# Altium project IRAUPS3.PrjPCB
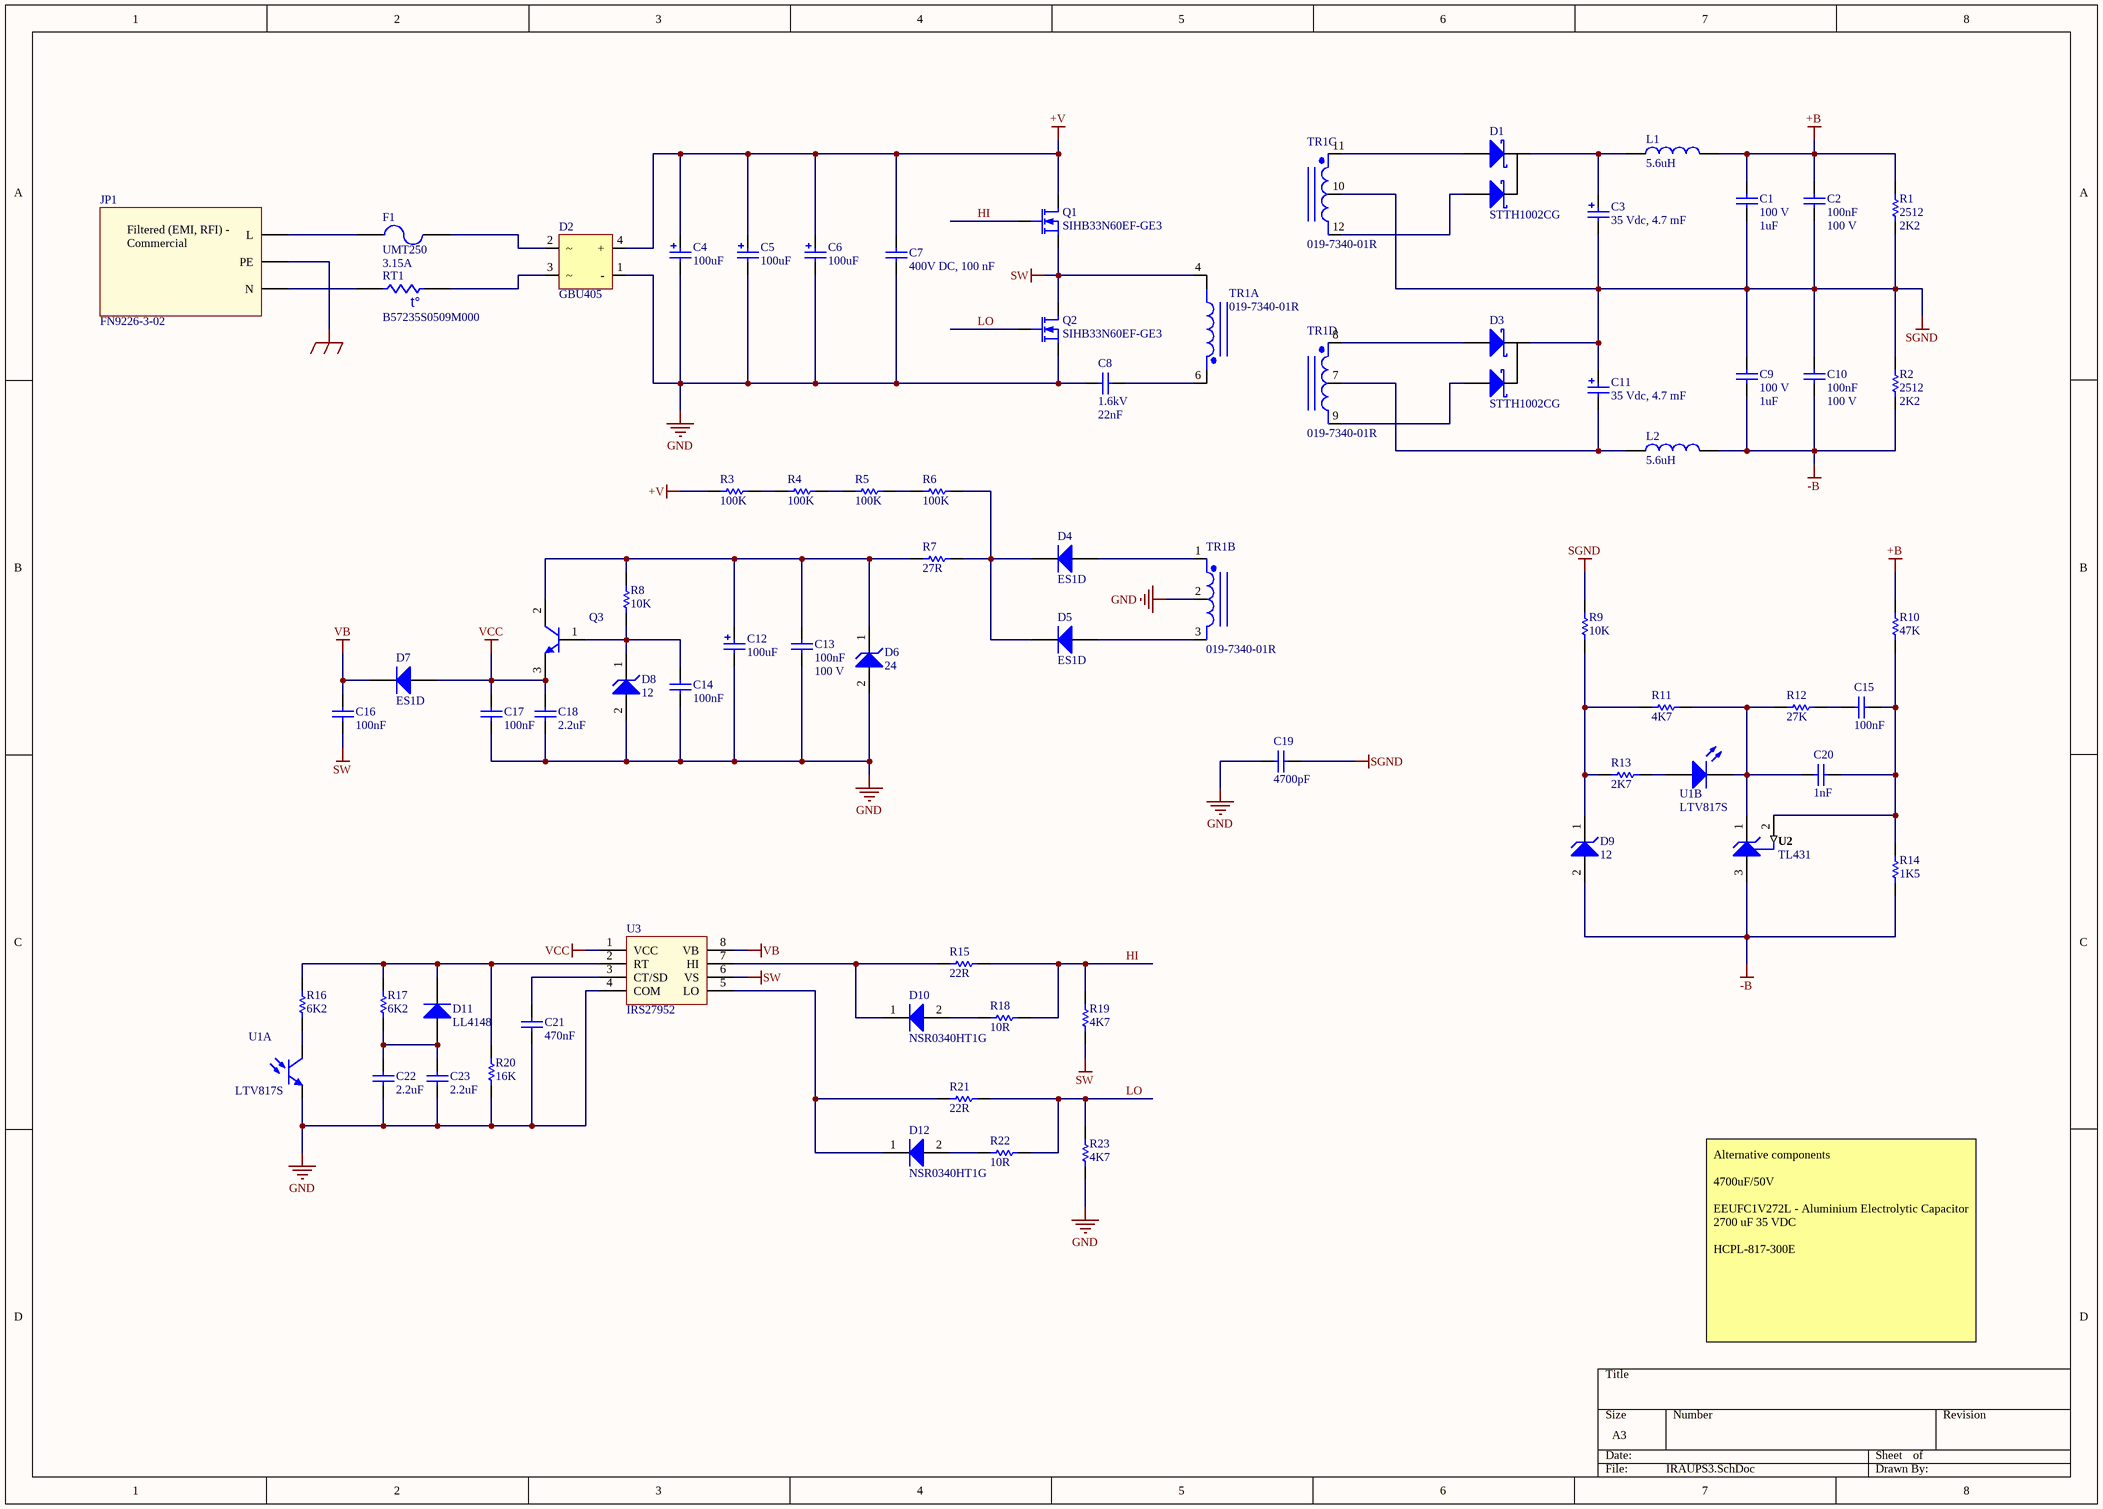
[diagram p0: IRAUPS3.SchDoc]
1 sheet, 70 parts. Net scope: global (net labels, ports and power ports of the same name join across sheets).
Board file: IRAUPS3.PcbDoc

## Sheet IRAUPS3.SchDoc
size A3

### Parts
C1  value 1uF  Rated Voltage: 100 V  [CAPC1206(3216)190_L]  (hidden comment: CAP 1uF 100V 1206(3216))
C2  value 100nF  Rated Voltage: 100 V  [CAPC1206(3216)150_M]  (hidden comment: CAP 100nF 100V 1206(3216))
C3  35 Vdc, 4.7 mF  [WCAP-ATG8_18x35.5x7.5]
C4  value 100uF  [WCAP-AT1H_16x35.5x7.5]  (hidden comment: 860241480001)
C5  value 100uF  [WCAP-AT1H_16x35.5x7.5]  (hidden comment: 860241480001)
C6  value 100uF  [WCAP-AT1H_16x35.5x7.5]  (hidden comment: 860241480001)
C7  400V DC, 100 nF  [WCAP-FTBE_13x5x11]
C8  value 22nF  Voltage: 1.6kV  [CAP_RM15_W9L18]  (hidden comment: B32672L1223J000)
C9  value 1uF  Rated Voltage: 100 V  [CAPC1206(3216)190_L]  (hidden comment: CAP 1uF 100V 1206(3216))
C10  value 100nF  Rated Voltage: 100 V  [CAPC1206(3216)150_M]  (hidden comment: CAP 100nF 100V 1206(3216))
C11  35 Vdc, 4.7 mF  [WCAP-ATG8_18x35.5x7.5]
C12  value 100uF  [WCAP-AT1H_8x11.5x3.5]  (hidden comment: 860240474005)
C13  value 100nF  Rated Voltage: 100 V  [CAPC1206(3216)150_M]  (hidden comment: CAP 100nF 100V 1206(3216))
C14  value 100nF  [CAPC0805(2012)100_N]  (hidden comment: CAP 100nF 25V 0805(2012))
C15  value 100nF  [CAPC0805(2012)100_N]  (hidden comment: CAP 100nF 25V 0805(2012))
C16  value 100nF  [CAPC0805(2012)100_N]  (hidden comment: CAP 100nF 25V 0805(2012))
C17  value 100nF  [CAPC0805(2012)100_N]  (hidden comment: CAP 100nF 25V 0805(2012))
C18  value 2.2uF  [CAPC0805(2012)145_N]  (hidden comment: CAP 2.2uF 25V 0805(2012))
C19  value 4700pF  [CAP_VY2472M49Y5US63V7]  (hidden comment: VY2472M49Y5US63V7)
C20  value 1nF  [CAPC0805(2012)100_N]  (hidden comment: CAP 1nF 25V 0805(2012))
C21  value 470nF  [CAPC0805(2012)100_N]  (hidden comment: CAP 470nF 25V 0805(2012))
C22  value 2.2uF  [CAPC0805(2012)145_N]  (hidden comment: CAP 2.2uF 25V 0805(2012))
C23  value 2.2uF  [CAPC0805(2012)145_N]  (hidden comment: CAP 2.2uF 25V 0805(2012))
D1  STTH1002CG  [TO-263_L]
D2  GBU405  [DIOD_BRIDGE_GBU]
D3  STTH1002CG  [TO-263_L]
D4  ES1D  [FAIR-SMA-2_V]
D5  ES1D  [FAIR-SMA-2_V]
D6  VZ Typ (V): 24  [ONSC-SMA-2-403D-02_F_V]  (hidden comment: 1SMA5934BT3G)
D7  ES1D  [FAIR-SMA-2_V]
D8  VZ Typ (V): 12  [ONSC-SMA-2-403D-02_F_V]  (hidden comment: 1SMA5927BT3G)
D9  VZ Typ (V): 12  [ONSC-SMA-2-403D-02_F_V]  (hidden comment: 1SMA5927BT3G)
D10  NSR0340HT1G  [ONSC-SOD-323-2-477-02_V]
D11  LL4148  [DIOD-SOD-80]
D12  NSR0340HT1G  [ONSC-SOD-323-2-477-02_V]
F1  UMT250  value 3.15A  [FUSE_UMT250]
JP1  FN9226-3-02  [CONN-FN9226-3-02]
L1  value 5.6uH  [WE-HCI_5040_WE-PERM 2]  (hidden comment: 744316560)
L2  value 5.6uH  [WE-HCI_5040_WE-PERM 2]  (hidden comment: 744316560)
Q1  SIHB33N60EF-GE3  [D2PAK_L]
Q2  SIHB33N60EF-GE3  [D2PAK_L]
Q3  2SC5569-TD-E  [ONSC-SOT-89-3-419AW_V]  (value not drawn)
R1  value 2K2  Case-EIA: 2512  [RESC2512(6432)_L]  (hidden comment: 2K2 5% 2512(6432))
R2  value 2K2  Case-EIA: 2512  [RESC2512(6432)_L]  (hidden comment: 2K2 5% 2512(6432))
R3  value 100K  [RESC1206(3216)_N]  (hidden comment: 100K 5% 1206(3216))
R4  value 100K  [RESC1206(3216)_N]  (hidden comment: 100K 5% 1206(3216))
R5  value 100K  [RESC1206(3216)_N]  (hidden comment: 100K 5% 1206(3216))
R6  value 100K  [RESC1206(3216)_N]  (hidden comment: 100K 5% 1206(3216))
R7  value 27R  [RESC0805(2012)_N]  (hidden comment: 27R 5% 0805(2012))
R8  value 10K  [RESC0805(2012)_N]  (hidden comment: 10K 5% 0805(2012))
R9  value 10K  [RESC0805(2012)_N]  (hidden comment: 10K 5% 0805(2012))
R10  value 47K  [RESC0805(2012)_N]  (hidden comment: 47K 5% 0805(2012))
R11  value 4K7  [RESC0805(2012)_N]  (hidden comment: 4K7 5% 0805(2012))
R12  value 27K  [RESC0805(2012)_N]  (hidden comment: 27K 5% 0805(2012))
R13  value 2K7  [RESC0805(2012)_N]  (hidden comment: 2K7 5% 0805(2012))
R14  value 1K5  [RESC0805(2012)_L]  (hidden comment: 1K5 5% 0805(2012))
R15  value 22R  [RESC0805(2012)_N]  (hidden comment: 22R 5% 0805(2012))
R16  value 6K2  [RESC0805(2012)_N]  (hidden comment: 6K2 1% 0805(2012))
R17  value 6K2  [RESC0805(2012)_N]  (hidden comment: 6K2 1% 0805(2012))
R18  value 10R  [RESC0805(2012)_N]  (hidden comment: 10R 5% 0805(2012))
R19  value 4K7  [RESC0805(2012)_N]  (hidden comment: 4K7 5% 0805(2012))
R20  value 16K  [RESC0805(2012)_N]  (hidden comment: 16K 1% 0805(2012))
R21  value 22R  [RESC0805(2012)_N]  (hidden comment: 22R 5% 0805(2012))
R22  value 10R  [RESC0805(2012)_N]  (hidden comment: 10R 5% 0805(2012))
R23  value 4K7  [RESC0805(2012)_N]  (hidden comment: 4K7 5% 0805(2012))
RT1  B57235S0509M000  [RES_TH_9.5mm]
TR1  019-7340-01R  [TRAN_019-7340-01R]  (parts A,B,C,D of 4)
U1  LTV817S  [SMD-4]  (parts A,B of 2)
U2  TL431  [DBZ0003A_M]
U3  IRS27952  [SOIC8_L]

### Nets
+B: C1.2 C2.2 L1.2 R1.2 R10.2
+V: C4.1(P) C5.1(P) C6.1(P) C7.2 D2.4(+) Q1.4(D) R3.2
-B: C9.1 C10.1 D9.2(A) L2.2 R2.1 R14.2 U2.3(ANODE)
GND: C4.2(N) C5.2(N) C6.2(N) C7.1 C8.1 C12.2(N) C13.1 C14.1 C17.1 C18.1 C19.1 C21.1 C22.1 C23.1 D2.1(-) D6.2(A) D8.2(A) Q2.3(S) R20.1 R23.1 TR1.2 U1.3(E) U3.4(COM)
PE: JP1.PE
SGND: C1.1 C2.1 C3.2(N) C9.2 C10.2 C11.1(P) C19.2 D3.4(K) R1.1 R2.2 R9.2 TR1.10
SW: C16.1 Q1.3(S) Q2.4(D) R19.1 TR1.4 U3.6(VS)
VB: C16.2 D7.1(K) U3.8(VB)
VCC: C17.2 C18.2 D7.2(A) Q3.3(E) U3.1(VCC)
HI: Q1.1(G) R15.2 R18.2 R19.2
LO: Q2.1(G) R21.2 R22.2 R23.2
NetC3_1: C3.1(P) D1.4(K) L1.1
NetC8_2: C8.2 TR1.6
NetC11_2: C11.2(N) L2.1 TR1.7
NetC12_1: C12.1(P) C13.2 D6.1(K) Q3.2(C) R7.2 R8.2
NetC14_2: C14.2 D8.1(K) Q3.1(B) R8.1
NetC15_1: C15.1 R12.2
NetC15_2: C15.2 C20.2 R10.1 R14.1 U2.2(REF)
NetC20_1: C20.1 R11.1 R12.1 U1.2(K) U2.1(CATHODE)
NetC21_2: C21.2 U3.3(CT/SD)
NetC22_2: C22.2 C23.2 D11.1(A) R17.1
NetD1_1: D1.1(A1) TR1.11
NetD1_3: D1.3(A2) TR1.12
NetD2_2: D2.2 F1.2
NetD2_3: D2.3 RT1.1
NetD3_1: D3.1(A1) TR1.8
NetD3_3: D3.3(A2) TR1.9
NetD4_1: D4.1(K) D5.1(K) R6.1 R7.1
NetD4_2: D4.2(A) TR1.1
NetD5_2: D5.2(A) TR1.3
NetD9_1: D9.1(K) R9.1 R11.2 R13.2
NetD10_1: D10.1(K) R15.1 U3.7(HI)
NetD10_2: D10.2(A) R18.1
NetD11_2: D11.2(K) R16.2 R17.2 R20.2 U3.2(RT)
NetD12_1: D12.1(K) R21.1 U3.5(LO)
NetD12_2: D12.2(A) R22.1
NetF1_1: F1.1 JP1.L
NetJP1_N: JP1.N RT1.2
NetR3_1: R3.1 R4.2
NetR4_1: R4.1 R5.2
NetR5_1: R5.1 R6.2
NetR13_1: R13.1 U1.1(A)
NetR16_1: R16.1 U1.4(C)

### Notes on the sheet
- Alternative components
  4700uF/50V
  EEUFC1V272L - Aluminium Electrolytic Capacitor 2700 uF 35 VDC
  HCPL-817-300E
- (in symbol CONN_FN9226-3-02) Filtered (EMI, RFI) - Commercial
- (in symbol RES_B57235S0509M000) t°

### Library data of the parts
C1 C9 = CMP-1037-04729-1: CAP 1uF 100V ±20% 1206 (3216 Metric) Thickness 1.9mm SMD; Case-EIA: 1206; Case-Metric: 3216; Tolerance: Â±20%; Max Thickness: 1.9 mm; Technology: SMT
C2 C10 C13 = CMP-1037-04216-1: CAP 100nF 100V ±20% 1206 (3216 Metric) Thickness 1.45mm SMD; Case-Metric: 3216; Case-EIA: 1206; Tolerance: Â±20%; Max Thickness: 1.45 mm; Technology: SMT
C3 C11 = 860010581025: WCAP-ATG8 Aluminum Electrolytic Capacitors, 18x35.5mm, 35 Vdc, 4.7 mF; Rated Voltage: 35 Vdc; Value: 4.7 mF; ComponentLink1Description: Manufacturer; ComponentLink1URL: http://www.we-online.de; ComponentLink2Description: Datasheet; ComponentLink2URL: http://katalog.we-online.de/pbs/datasheet/860010581025.pdf; Part Number: 860010581025; Published Date: Sep. 2017; Publisher: Wurth Elektronik; Size: 18x35.5mm; Life Cycle: 2000h; Operating Temperature: -40 °C up to +85 °C
C4-C6 = 860241480001: WCAP-AT1H Aluminum Electrolytic Capacitors, size Ф16x35.5mm, 450V DC, 100uF; Rated Voltage: 450V DC; ComponentLink1Description: Manufacturer; ComponentLink1URL: http://www.we-online.de; ComponentLink2Description: Datasheet; ComponentLink2URL: http://katalog.we-online.de/pbs/datasheet/860241480001.pdf; Part Number: 860241480001; Published Date: June 2017; Publisher: Wurth Elektronik; Size: Ф16x35.5mm; Life Cycle: 5000h; Operating Temperature: -25 °C up to +105 °C
C7 = 890283423001CS: WCAP-FTBE Film Capacitors, 13x5x11mm, 400V DC, 100 nF; Rated Voltage: 400V DC; Value: 100 nF; ComponentLink1Description: Manufacturer; ComponentLink1URL: http://www.we-online.de; ComponentLink2Description: Datasheet; ComponentLink2URL: http://katalog.we-online.de/pbs/datasheet/890283423001CS.pdf; Part Number: 890283423001CS; Published Date: Sep. 2017; Publisher: Wurth Elektronik; Size: 13x5x11mm; Operating Temperature: -40 °C to +85 °C
C8 = CAP_MKP_B32672L1223J000: 0.022µF Film Capacitor 600V 1600V (1.6kV) Polypropylene (PP), Metallized Radial; PackageReference: RM15; Farnell: 2469009; MPN: B32672L1223J000; DigiKey: 495-3217-ND
C12 = 860240474005: WCAP-AT1H Aluminum Electrolytic Capacitors, size Ф8x11.5mm, 25V DC, 100uF; Rated Voltage: 25V DC; ComponentLink1Description: Manufacturer; ComponentLink1URL: http://www.we-online.de; ComponentLink2Description: Datasheet; ComponentLink2URL: http://katalog.we-online.de/pbs/datasheet/860240474005.pdf; Part Number: 860240474005; Published Date: June 2017; Publisher: Wurth Elektronik; Size: Ф8x11.5mm; Life Cycle: 8000h; Operating Temperature: -40 °C up to +105 °C
C14-C17 = CMP-1036-04409-1: CAP 100nF 25V ±5% 0805 (2012 Metric) Thickness 1mm SMD; Case-EIA: 0805; Case-Metric: 2012; Tolerance: Â±5%; Max Thickness: 1 mm; Technology: SMT; Rated Voltage: 25 V
C18 C22 C23 = CMP-1036-04837-1: CAP 2.2uF 25V ±10% 0805 (2012 Metric) Thickness 1.45mm SMD; Case-EIA: 0805; Tolerance: Â±10%; Case-Metric: 2012; Technology: SMT; Max Thickness: 1.45 mm; Rated Voltage: 25 V
C19 = CAP_VY2_4700: 4700pF ±20% 440VAC Ceramic Capacitor Y5U (E) Radial, Disc; PackageReference: THD; FARNELL: 1902233; MPN: VY2472M49Y5US63V7; Voltage: 440VAC; DigiKey: BC2359-ND
C20 = CMP-1036-02968-1: CAP 1nF 25V ±10% 0805 (2012 Metric) Thickness 1mm SMD; Case-EIA: 0805; Tolerance: Â±10%; Case-Metric: 2012; Rated Voltage: 25 V; Technology: SMT; Max Thickness: 1 mm
C21 = CMP-1036-04646-1: CAP 470nF 25V ±10% 0805 (2012 Metric) Thickness 1mm SMD; Tolerance: Â±10%; Case-EIA: 0805; Case-Metric: 2012; Max Thickness: 1 mm; Rated Voltage: 25 V; Technology: SMT
D1 D3 = DIODE-STTH1002CG: Diode Array 1 Pair Common Cathode Schottky 60V 15A Through Hole TO-220-3; MPN: STTH1002CG
D2 = DIOD_BRIDGE_GBU405: IC RECT BRIDGE 0.5A 600V 4SOIC; MPN: GBU405; Farnell: 4084780
D4 D5 D7 = CMP-2000-06230-1: Fairchild ES1D Diode, 200 V, 1 A, -50 to 150 degC, 2-Pin SMA, RoHS, Cut Tape; Manufacturer: Fairchild Semiconductor; Reverse Recovery Time-Max: 15ns; Reverse Current-Max: 5µA; Reverse Voltage-Max [Vrrm]: 200V; Power Dissipation: 1470mW; Average Rectified Current-Max: 1A; Forward Voltage: 0.92V; Datasheet URL: https://datasheet.ciiva.com/5739/575529-5739201.pdf; Datasheet Version: Rev. C1; Package Reference: SMA-2; Manufacturer URL: https://www.fairchildsemi.com/; Package Description: 2-Pin SMA, Body 4.292 x 2.693 mm; VRRM: 200V; Mounting Technology: SurfaceMount; IF: 1A; PartNumber: ES1D
D6 = CMP-1060-00064-1: 1.5 W Zener Voltage Regulator, 2-Pin SMA, Pb-Free, Tape and Reel; Manufacturer: On Semiconductor; Packing: Tape and Reel; PackageReference: SMA-2-403D-02_F; ComponentLink1Description: Manufacturer URL; ComponentLink2URL: http://www.onsemi.com/pub_link/Collateral/1SMA5913BT3-D.PDF; PackageDescription: 2-Pin Small Molded Package, J-Bend Lead, Body 2.605 x 4.315 mm; ComponentLink2Description: Datasheet; PackageVersion: Rev. F, 11/2008; RoHS: Pb-Free; ComponentLink3Description: Package Specification; DatasheetVersion: Rev. 8; PartNumber: 1SMA5934BT3G; ComponentLink1URL: http://www.onsemi.com/; Mounting Technology: Surface Mount; ComponentLink3URL: http://www.onsemi.com/pub_link/Collateral/1SMA5913BT3-D.PDF
D8 D9 = CMP-1060-00103-1: 1.5 W Zener Voltage Regulator, 2-Pin SMA, Pb-Free, Tape and Reel; Manufacturer: On Semiconductor; DatasheetVersion: Rev. 8; Mounting Technology: Surface Mount; RoHS: Pb-Free; Packing: Tape and Reel; ComponentLink2Description: Datasheet; ComponentLink1URL: http://www.onsemi.com/; PackageDescription: 2-Pin Small Molded Package, J-Bend Lead, Body 2.605 x 4.315 mm; PackageReference: SMA-2-403D-02_F; PartNumber: 1SMA5927BT3G; ComponentLink3URL: http://www.onsemi.com/pub_link/Collateral/1SMA5913BT3-D.PDF; ComponentLink1Description: Manufacturer URL; ComponentLink2URL: http://www.onsemi.com/pub_link/Collateral/1SMA5913BT3-D.PDF; PackageVersion: Rev. F, 11/2008; ComponentLink3Description: Package Specification
D10 D12 = CMP-1055-00472-1: Schottky Barrier Diode, 2-Pin SOD-323, Pb-Free, Tape and Reel; Manufacturer: On Semiconductor; IFSM Max (A): 1; Configuration: Single; PackageDescription: 2-Pin SOD, Body 1.7 x 1.25 mm; ComponentLink2Description: Datasheet; PartNumber: NSR0340HT1G; ComponentLink3URL: http://www.onsemi.com/pub_link/Collateral/477-02.PDF.1; Packing: Tape and Reel; PackageVersion: Rev. H, 03/2007; ComponentLink1URL: http://www.onsemi.com/; ComponentLink2URL: http://www.onsemi.cn/pub_link/Collateral/NSR0340H-D.PDF; ComponentLink3Description: Package Specification; ComponentLink1Description: Manufacturer URL; Mounting Technology: Surface Mount; RoHS: TRUE; PackageReference: SOD-323-2-477-02; DatasheetVersion: Rev. 1
D11 = DIOD_GP_LL4148: DIODE GEN PURP 100V 200MA SOD80; Code_JEDEC: SOD-80; FARNELL: 2101203; DigiKey: LL4148FSTR-ND; MPN: LL4148
F1 = FUSE_UMT250-3.15A: Fuse; MPN: 3403.0171.11; ELFA: 13322670; Farnell: 1221095; DigiKey: 486-1252-ND
JP1 = CONN_FN9226-3-02: Power Entry Connector Receptacle, Male Blades IEC 320-C14 Panel Mount, Flange; Through Hole, Right Angle; MPN: FN9226-3-02
L1 L2 = 744316560: WE-HCI SMD Flat Wire High Current Inductor, size 5040, 4.5A, 5.6uH; Material: WE-PERM 2; ComponentLink1Description: Manufacturer; ComponentLink1URL: http://www.we-online.de; ComponentLink2Description: Datasheet; ComponentLink2URL: http://katalog.we-online.de/pbs/datasheet/744316560.pdf; Part Number: 744316560; Published Date: July 2017; Publisher: Wurth Elektronik; Rated Current: 4.5A; Size: 5040
Q1 Q2 = TRAN_SIHB33N60EF-GE3: N-Channel 600V 33A (Tc) 278W (Tc) Surface Mount D²PAK (TO-263); MPN: SIHB33N60EF-GE3
Q3 = CMP-1050-00111-1: Bipolar Transistor, 50 V, 7 A, Low VCE(sat), NPN Single, 3-Pin SOT-89, Pb-Free, Tape and Reel; Manufacturer: On Semiconductor; IC Continuous (A): 7; hFE Max: 560; V(BR)CEO Min (V): 50; hFE Min: 200; ComponentLink2URL: http://www.onsemi.com/pub_link/Collateral/EN6309-D.PDF; PackageReference: SOT-89-3-419AW; ComponentLink1Description: Manufacturer URL; PartNumber: 2SC5569-TD-E; ComponentLink3Description: Package Specification; Mounting Technology: Surface Mount; PackageVersion: Rev. O, 04/2012; PackageDescription: 3-Pin Small Outline Transistor, Body 4.5 x 2.5 mm, Pitch 1.5 mm; RoHS: TRUE; Polarity: NPN; Packing: Tape and Reel; ComponentLink3URL: http://www.onsemi.com/pub_link/Collateral/419AW.PDF; ComponentLink1URL: http://www.onsemi.com/; ComponentLink2Description: Datasheet
R1 R2 = CMP-1018-00082-1: 2K2 1W 5% 2512 (6432 Metric)  SMD; Case-Metric: 6432; Technology: SMT; Power: 1 W; Tolerance: 5 %
R3-R6 = CMP-1014-00122-1: 100K 0.25W 5% 1206 (3216 Metric)  SMD; Case-EIA: 1206; Case-Metric: 3216; Technology: SMT; Power: 0.25 W; Tolerance: 5 %
R7 = CMP-1013-00036-1: 27R 0.125W 5% 0805 (2012 Metric)  SMD; Case-EIA: 0805; Case-Metric: 2012; Technology: SMT; Tolerance: 5 %; Power: 0.125 W
R8 R9 = CMP-1013-00098-1: 10K 0.125W 5% 0805 (2012 Metric)  SMD; Case-EIA: 0805; Case-Metric: 2012; Power: 0.125 W; Technology: SMT; Tolerance: 5 %
R10 = CMP-1013-00114-1: 47K 0.125W 5% 0805 (2012 Metric)  SMD; Case-Metric: 2012; Case-EIA: 0805; Tolerance: 5 %; Power: 0.125 W; Technology: SMT
R11 R19 R23 = CMP-1013-00090-1: 4K7 0.125W 5% 0805 (2012 Metric)  SMD; Case-EIA: 0805; Case-Metric: 2012; Power: 0.125 W; Tolerance: 5 %; Technology: SMT
R12 = CMP-1013-00108-1: 27K 0.125W 5% 0805 (2012 Metric)  SMD; Case-Metric: 2012; Case-EIA: 0805; Power: 0.125 W; Technology: SMT; Tolerance: 5 %
R13 = CMP-1013-00084-1: 2K7 0.125W 5% 0805 (2012 Metric)  SMD; Case-EIA: 0805; Case-Metric: 2012; Technology: SMT; Power: 0.125 W; Tolerance: 5 %
R14 = CMP-1013-00078-1: 1K5 0.125W 5% 0805 (2012 Metric)  SMD; Case-EIA: 0805; Case-Metric: 2012; Power: 0.125 W; Technology: SMT; Tolerance: 5 %
R15 R21 = CMP-1013-00034-1: 22R 0.125W 5% 0805 (2012 Metric)  SMD; Case-Metric: 2012; Case-EIA: 0805; Power: 0.125 W; Technology: SMT; Tolerance: 5 %
R16 R17 = CMP-1013-00599-1: 6K2 0.125W 1% 0805 (2012 Metric)  SMD; Case-Metric: 2012; Case-EIA: 0805; Power: 0.125 W; Tolerance: 1 %; Technology: SMT
R18 R22 = CMP-1013-00026-1: 10R 0.125W 5% 0805 (2012 Metric)  SMD; Case-EIA: 0805; Case-Metric: 2012; Technology: SMT; Power: 0.125 W; Tolerance: 5 %
R20 = CMP-1013-00644-1: 16K 0.125W 1% 0805 (2012 Metric)  SMD; Case-EIA: 0805; Case-Metric: 2012; Tolerance: 1 %; Power: 0.125 W; Technology: SMT
RT1 = RES_B57235S0509M000: Inrush Current Limiter 5 Ohms ±20% 4.2A 0.374" (9.50mm); MPN: B57235S0509M000
TR1 = TRANS_019-7340-01R: LLC transformer; MPN: 019-7340-01R
U1 = OPTO-LTV817S: Optoisolator Transistor Output 5000Vrms 1 Channel 4-SMD; Published: 8-Jun-2000; PackageReference: SOT-23B; MPN: LTV817S
U2 = CMP-0366-01226-2: Automotive Catalog Adjustable Precision Shunt Regulator, 34 ppm / degC, 100 mA, -40 to 125 degC, 3-pin SOT-23 (DBZ), Green (RoHS & no Sb/Br); PartNumber: TL431AQDBZRQ1; Manufacturer: Texas Instruments; Iout/Iz(Max)(mA): 100; VO Adj(Max)(V): 36; SubFamily: Shunt Voltage Reference; VO Adj(Min)(V): 2.495; Initial Accuracy @ 25/deg C(%): 1; Min Iz for Regulation(uA): 600; Temp Coeff(Typ)(ppm/ degree C): 34; ComponentLink3Description: Package Specification; ComponentLink3URL: http://www.ti.com/litv/pdf/mpds108a; PackageVersion: 4203227/B; Eco-Plan: Green (RoHS & no Sb/Br); Code_JEDEC: TO-236; PackageReference: DBZ0003A; ComponentLink2Description: Datasheet; ComponentLink1URL: http://www.ti.com/; Rating: Automotive; PackageDescription: 3-Pin Plastic Small Outline, Body 2.92 x 1.3 mm, Pitch 0.95 mm; ComponentLink1Description: Manufacturer URL; DatasheetVersion: SGLS302C; ComponentLink2URL: http://www.ti.com/general/docs/lit/getliterature.tsp?genericPartNumber=TL431A-Q1&fileType=pdf; Mounting Technology: Surface Mount
U3 = IC-PMIC-IRS27952: IC REG CTRLR BUCK/HALF-BRG 8SOIC; MPN: IRS27952SPBF; DigiKey: IRS27952SPBF-ND; Farnell: 1866043